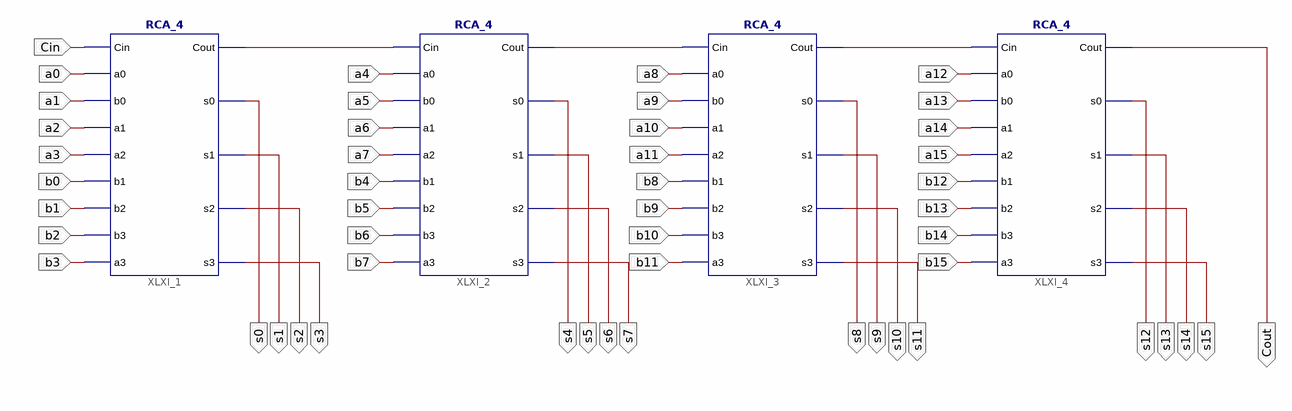
[diagram p0: schematic sheet 1]
// Xilinx ISE schematic RCA_16.sch (spartan3e) as structural Verilog: 4 symbols, 50 ports
module RCA_16 (
  input  Cin,
  input  a0,
  input  a1,
  input  a2,
  input  a3,
  input  b0,
  input  b1,
  input  b2,
  input  b3,
  input  a4,
  input  a5,
  input  a6,
  input  a7,
  input  b4,
  input  b5,
  input  b6,
  input  b7,
  input  a8,
  input  a9,
  input  a10,
  input  a11,
  input  b8,
  input  b9,
  input  b10,
  input  b11,
  input  a12,
  input  a13,
  input  a14,
  input  a15,
  input  b12,
  input  b13,
  input  b14,
  input  b15,
  output s0,
  output s4,
  output Cout,
  output s1,
  output s2,
  output s3,
  output s5,
  output s6,
  output s7,
  output s9,
  output s10,
  output s8,
  output s11,
  output s13,
  output s14,
  output s15,
  output s12
);

  wire XLXN_1, XLXN_2, XLXN_3;

  RCA_4 XLXI_1 (
    .Cin(Cin), .a0(a0), .b0(a1), .a1(a2), .a2(a3), .b1(b0), .b2(b1), .b3(b2), .a3(b3), .Cout(XLXN_1),
    .s0(s0), .s1(s1), .s2(s2), .s3(s3));
  RCA_4 XLXI_2 (
    .Cin(XLXN_1), .a0(a4), .b0(a5), .a1(a6), .a2(a7), .b1(b4), .b2(b5), .b3(b6), .a3(b7), .Cout(XLXN_2),
    .s0(s4), .s1(s5), .s2(s6), .s3(s7));
  RCA_4 XLXI_3 (
    .Cin(XLXN_2), .a0(a8), .b0(a9), .a1(a10), .a2(a11), .b1(b8), .b2(b9), .b3(b10), .a3(b11), .Cout(XLXN_3),
    .s0(s8), .s1(s9), .s2(s10), .s3(s11));
  RCA_4 XLXI_4 (
    .Cin(XLXN_3), .a0(a12), .b0(a13), .a1(a14), .a2(a15), .b1(b12), .b2(b13), .b3(b14), .a3(b15),
    .Cout(Cout), .s0(s12), .s1(s13), .s2(s14), .s3(s15));
endmodule
